# EAGLE design 1.0 (EAGLE 9.2.2)
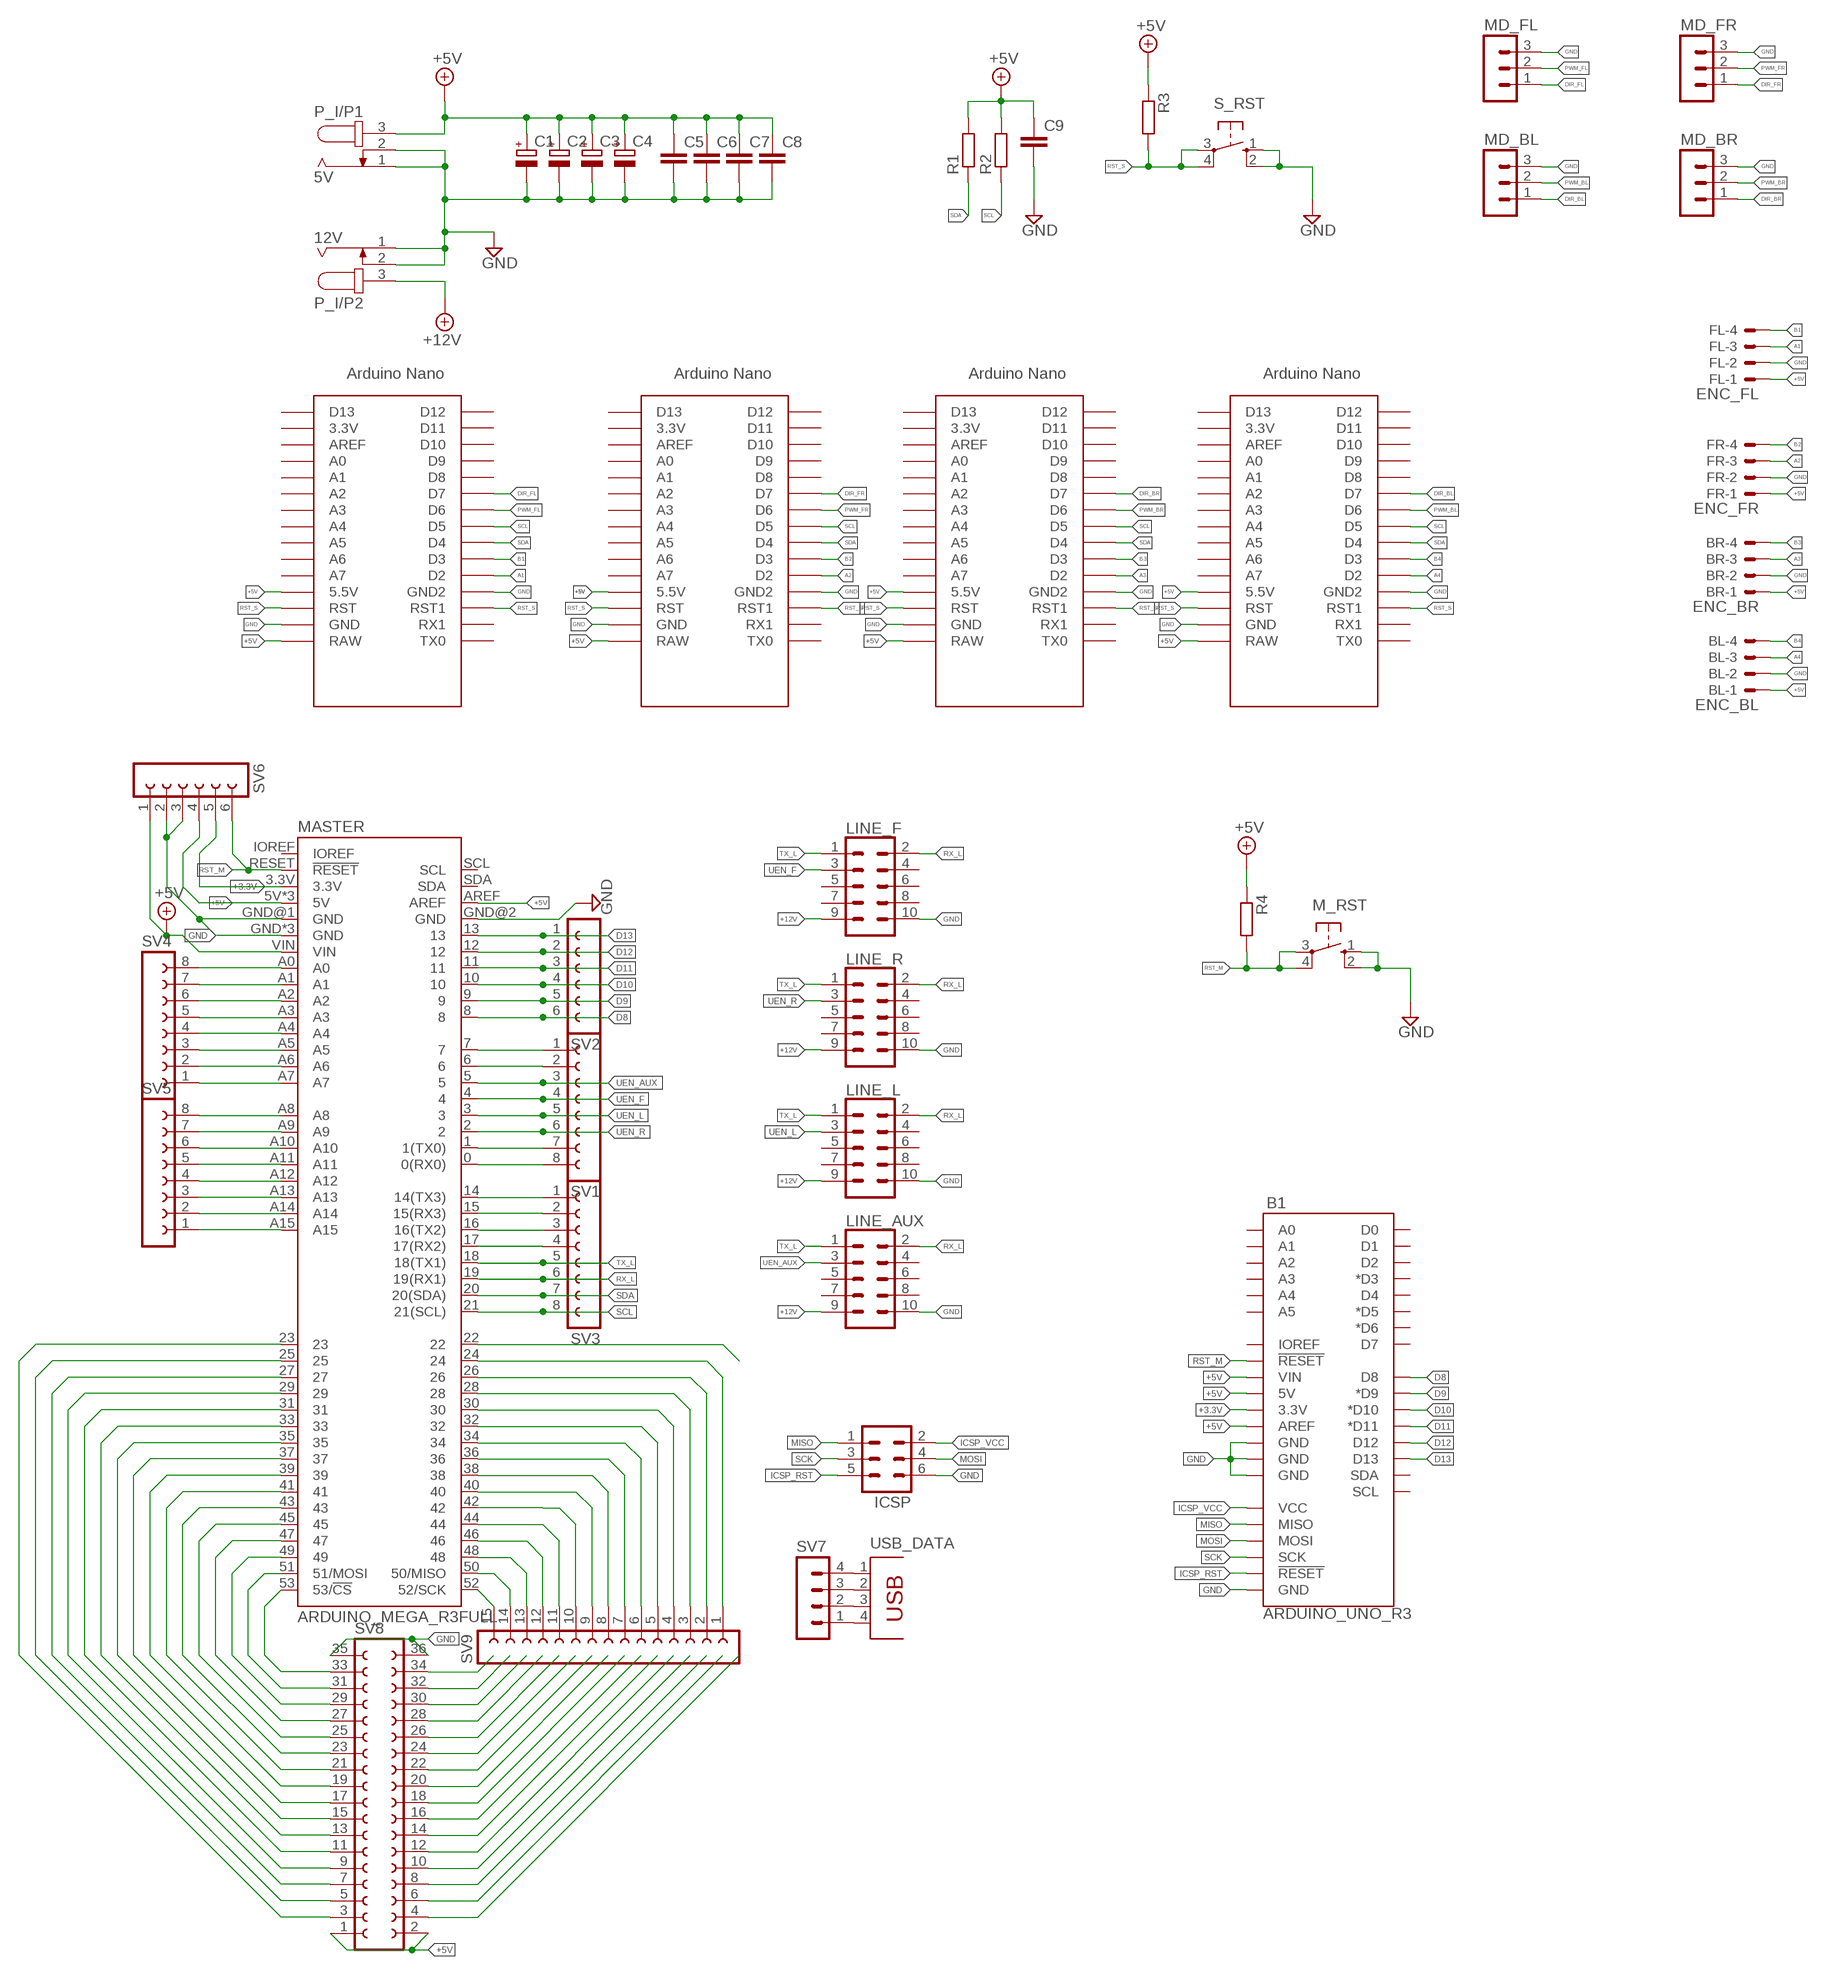
[diagram p0: schematic, sheet 1]

## Parts
B1  ARDUINO_UNO_R3  [ARDUINO_R3]
BL  ENC_BL  22-23-2041  [22-23-2041]
BR  ENC_BR  22-23-2041  [22-23-2041]
C1  CPOL-EUE5-10.5  [E5-10,5]
C2  CPOL-EUE5-10.5  [E5-10,5]
C3  CPOL-EUE5-10.5  [E5-10,5]
C4  CPOL-EUE5-10.5  [E5-10,5]
C5  C-EU050-035X075  [C050-035X075]
C6  C-EU050-035X075  [C050-035X075]
C7  C-EU050-035X075  [C050-035X075]
C8  C-EU050-035X075  [C050-035X075]
C9  C-EU050-035X075  [C050-035X075]
FL  ENC_FL  22-23-2041  [22-23-2041]
FR  ENC_FR  22-23-2041  [22-23-2041]
ICSP  MA03-2  [MA03-2]
LINE_AUX  CONN_05X2SHD_LOCK  [2X5-SHROUDED_LOCK]
LINE_F  CONN_05X2SHD_LOCK  [2X5-SHROUDED_LOCK]
LINE_L  CONN_05X2SHD_LOCK  [2X5-SHROUDED_LOCK]
LINE_R  CONN_05X2SHD_LOCK  [2X5-SHROUDED_LOCK]
M_RST  10-XX  [B3F-10XX]
MASTER  ARDUINO_MEGA_R3FULL  [ARDUINO_MEGA_NO_SILK]
MD_BL  MA03-1  [MA03-1]
MD_BR  MA03-1  [MA03-1]
MD_FL  MA03-1  [MA03-1]
MD_FR  MA03-1  [MA03-1]
P_I/P1  5V  JACK-PLUG1  [SPC4078]
P_I/P2  12V  JACK-PLUG1  [SPC4078]
R1  R-EU_0207/10  [0207/10]
R2  R-EU_0207/10  [0207/10]
R3  R-EU_0207/10  [0207/10]
R4  R-EU_0207/10  [0207/10]
S_RST  10-XX  [B3F-10XX]
SLAVE_0  NANO_08  NANO  [NANO]
SLAVE_1  NANO_09  NANO  [NANO]
SLAVE_2  NANO_11  NANO  [NANO]
SLAVE_3  NANO_10  NANO  [NANO]
SV1  FE08-1  [FE08]
SV2  FE06-1  [FE06]
SV3  FE08-1  [FE08]
SV4  FE08-1  [FE08]
SV5  FE08-1  [FE08]
SV6  FE06-1  [FE06]
SV7  MA04-1  [MA04-1]
SV8  FE18-2  [FE18-2]
SV9  FE15-1  [FE15]
USB_DATA  PN61729  [PN61729]

## Nets
+3.3V [power]: B1.3.3V MASTER.3.3V SV6.5
+5V: B1.5V B1.AREF B1.VIN BL.1 BR.1 C1.+ C2.+ C3.+ C4.+ C5.1 C6.1 C7.1 C8.1 C9.1 FL.1 FR.1 MASTER.5V MASTER.5V@1(5V) MASTER.5V@2(5V) MASTER.AREF MASTER.VIN P_I/P1.3 R1.2 R2.2 R3.1 R4.1 SLAVE_0.5V(5.5V) SLAVE_0.RAW SLAVE_1.5V(5.5V) SLAVE_1.RAW SLAVE_2.5V(5.5V) SLAVE_2.RAW SLAVE_3.5V(5.5V) SLAVE_3.RAW SV6.1 SV6.4 SV8.1 SV8.2
+12V: LINE_AUX.9 LINE_F.9 LINE_L.9 LINE_R.9 P_I/P2.3
A1: FL.3 SLAVE_0.D2
A2: FR.3 SLAVE_1.D2
A3: BR.3 SLAVE_2.D2
A4: BL.3 SLAVE_3.D2
B1: FL.4 SLAVE_0.D3
B2: FR.4 SLAVE_1.D3
B3: BR.4 SLAVE_2.D3
B4: BL.4 SLAVE_3.D3
D8: B1.D8 MASTER.8 SV2.6
D9: B1.D9(*D9) MASTER.9 SV2.5
D10: B1.D10(*D10) MASTER.10 SV2.4
D11: B1.D11(*D11) MASTER.11 SV2.3
D12: B1.D12 MASTER.12 SV2.2
D13: B1.D13 MASTER.13 SV2.1
DIR_BL: MD_BL.1 SLAVE_3.D7
DIR_BR: MD_BR.1 SLAVE_2.D7
DIR_FL: MD_FL.1 SLAVE_0.D7
DIR_FR: MD_FR.1 SLAVE_1.D7
GND: B1.GND@1(GND) B1.GND@2(GND) B1.GND@4(GND) BL.2 BR.2 C1.- C2.- C3.- C4.- C5.2 C6.2 C7.2 C8.2 C9.2 FL.2 FR.2 ICSP.6 LINE_AUX.10 LINE_F.10 LINE_L.10 LINE_R.10 M_RST.1(S) M_RST.2(S1) MASTER.GND MASTER.GND@1(GND) MASTER.GND@2(GND) MASTER.GND@3(GND) MASTER.GND@4(GND) MD_BL.3 MD_BR.3 MD_FL.3 MD_FR.3 P_I/P1.1 P_I/P1.2 P_I/P2.1 P_I/P2.2 S_RST.1(S) S_RST.2(S1) SLAVE_0.GND SLAVE_0.GND1(GND2) SLAVE_1.GND SLAVE_1.GND1(GND2) SLAVE_2.GND SLAVE_2.GND1(GND2) SLAVE_3.GND SLAVE_3.GND1(GND2) SV6.2 SV6.3 SV8.35 SV8.36
ICSP_RST: B1.RESET@2(!RESET!) ICSP.5
ICSP_VCC: B1.VCC ICSP.2
MISO: B1.MISO ICSP.1
MOSI: B1.MOSI ICSP.4
N$1: MASTER.14(14(TX3)) SV3.1
N$2: SV7.1 USB_DATA.4
N$3: SV7.2 USB_DATA.3
N$4: SV7.3 USB_DATA.2
N$5: SV7.4 USB_DATA.1
N$6: MASTER.22
N$7: MASTER.24 SV9.1
N$8: MASTER.0(0(RX0)) SV1.8
N$9: MASTER.1(1(TX0)) SV1.7
N$10: MASTER.15(15(RX3)) SV3.2
N$11: MASTER.16(16(TX2)) SV3.3
N$12: MASTER.17(17(RX2)) SV3.4
N$13: MASTER.53(53/!CS) SV8.33
N$14: MASTER.6 SV1.2
N$15: MASTER.7 SV1.1
N$16: MASTER.51(51/MOSI) SV8.31
N$17: MASTER.26 SV9.2
N$18: MASTER.47 SV8.27
N$19: MASTER.49 SV8.29
N$20: MASTER.45 SV8.25
N$21: MASTER.43 SV8.23
N$22: MASTER.41 SV8.21
N$23: MASTER.39 SV8.19
N$24: MASTER.A0 SV4.8
N$25: MASTER.A1 SV4.7
N$26: MASTER.A2 SV4.6
N$27: MASTER.A3 SV4.5
N$28: MASTER.A4 SV4.4
N$29: MASTER.A5 SV4.3
N$30: MASTER.A6 SV4.2
N$31: MASTER.A7 SV4.1
N$32: MASTER.A8 SV5.8
N$33: MASTER.A9 SV5.7
N$34: MASTER.A10 SV5.6
N$35: MASTER.A11 SV5.5
N$36: MASTER.A12 SV5.4
N$37: MASTER.A13 SV5.3
N$38: MASTER.A14 SV5.2
N$39: MASTER.A15 SV5.1
N$40: MASTER.37 SV8.17
N$41: MASTER.35 SV8.15
N$42: MASTER.33 SV8.13
N$43: MASTER.31 SV8.11
N$44: MASTER.29 SV8.9
N$45: MASTER.27 SV8.7
N$46: MASTER.25 SV8.5
N$47: MASTER.23 SV8.3
N$48: SV8.4
N$49: SV8.6
N$50: SV8.8
N$51: SV8.10
N$52: SV8.12
N$53: SV8.14
N$54: SV8.16
N$55: SV8.18
N$56: SV8.20
N$57: SV8.22
N$58: MASTER.28 SV9.3
N$59: SV8.26
N$60: SV8.28
N$61: SV8.30
N$62: SV8.32
N$63: SV8.34
N$64: B1.GND@3(GND)
N$65: MASTER.30 SV9.4
N$66: MASTER.32 SV9.5
N$67: MASTER.34 SV9.6
N$68: MASTER.36 SV9.7
N$69: SV8.24
N$70: MASTER.38 SV9.8
N$71: MASTER.40 SV9.9
N$72: MASTER.42 SV9.10
N$73: MASTER.52(52/SCK) SV9.15
N$74: MASTER.50(50/MISO) SV9.14
N$75: MASTER.48 SV9.13
N$76: MASTER.46 SV9.12
N$77: MASTER.44 SV9.11
PWM_BL: MD_BL.2 SLAVE_3.D6
PWM_BR: MD_BR.2 SLAVE_2.D6
PWM_FL: MD_FL.2 SLAVE_0.D6
PWM_FR: MD_FR.2 SLAVE_1.D6
RST_M: B1.RESET@1(!RESET!) M_RST.3(P) M_RST.4(P1) MASTER.RESET(!RESET) R4.2 SV6.6
RST_S: R3.2 S_RST.3(P) S_RST.4(P1) SLAVE_0.RST SLAVE_0.RST1 SLAVE_1.RST SLAVE_1.RST1 SLAVE_2.RST SLAVE_2.RST1 SLAVE_3.RST SLAVE_3.RST1
RX_L: LINE_AUX.2 LINE_F.2 LINE_L.2 LINE_R.2 MASTER.19(19(RX1)) SV3.6
SCK: B1.SCK ICSP.3
SCL: MASTER.21(21(SCL)) R2.1 SLAVE_0.D5 SLAVE_1.D5 SLAVE_2.D5 SLAVE_3.D5 SV3.8
SDA: MASTER.20(20(SDA)) R1.1 SLAVE_0.D4 SLAVE_1.D4 SLAVE_2.D4 SLAVE_3.D4 SV3.7
TX_L: LINE_AUX.1 LINE_F.1 LINE_L.1 LINE_R.1 MASTER.18(18(TX1)) SV3.5
UEN_AUX: LINE_AUX.3 MASTER.5 SV1.3
UEN_F: LINE_F.3 MASTER.4 SV1.4
UEN_L: LINE_L.3 MASTER.3 SV1.5
UEN_R: LINE_R.3 MASTER.2 SV1.6
Unconnected: B1.A0 B1.A1 B1.A2 B1.A3 B1.A4 B1.A5 B1.D0 B1.D1 B1.D2 B1.D3(*D3) B1.D4 B1.D5(*D5) B1.D6(*D6) B1.D7 B1.IOREF B1.SCL B1.SDA LINE_AUX.4 LINE_AUX.5 LINE_AUX.6 LINE_AUX.7 LINE_AUX.8 LINE_F.4 LINE_F.5 LINE_F.6 LINE_F.7 LINE_F.8 LINE_L.4 LINE_L.5 LINE_L.6 LINE_L.7 LINE_L.8 LINE_R.4 LINE_R.5 LINE_R.6 LINE_R.7 LINE_R.8 MASTER.IOREF MASTER.SCL MASTER.SDA SLAVE_0.3.3V SLAVE_0.A0 SLAVE_0.A1 SLAVE_0.A2 SLAVE_0.A3 SLAVE_0.A4 SLAVE_0.A5 SLAVE_0.A6 SLAVE_0.A7 SLAVE_0.AREF SLAVE_0.D8 SLAVE_0.D9 SLAVE_0.D10 SLAVE_0.D11 SLAVE_0.D12 SLAVE_0.D13 SLAVE_0.ICSP1 SLAVE_0.ICSP2 SLAVE_0.ICSP3 SLAVE_0.ICSP4 SLAVE_0.ICSP5 SLAVE_0.ICSP6 SLAVE_0.RX1 SLAVE_0.TX0 SLAVE_1.3.3V SLAVE_1.A0 SLAVE_1.A1 SLAVE_1.A2 SLAVE_1.A3 SLAVE_1.A4 SLAVE_1.A5 SLAVE_1.A6 SLAVE_1.A7 SLAVE_1.AREF SLAVE_1.D8 SLAVE_1.D9 SLAVE_1.D10 SLAVE_1.D11 SLAVE_1.D12 SLAVE_1.D13 SLAVE_1.ICSP1 SLAVE_1.ICSP2 SLAVE_1.ICSP3 SLAVE_1.ICSP4 SLAVE_1.ICSP5 SLAVE_1.ICSP6 SLAVE_1.RX1 SLAVE_1.TX0 SLAVE_2.3.3V SLAVE_2.A0 SLAVE_2.A1 SLAVE_2.A2 SLAVE_2.A3 SLAVE_2.A4 SLAVE_2.A5 SLAVE_2.A6 SLAVE_2.A7 SLAVE_2.AREF SLAVE_2.D8 SLAVE_2.D9 SLAVE_2.D10 SLAVE_2.D11 SLAVE_2.D12 SLAVE_2.D13 SLAVE_2.ICSP1 SLAVE_2.ICSP2 SLAVE_2.ICSP3 SLAVE_2.ICSP4 SLAVE_2.ICSP5 SLAVE_2.ICSP6 SLAVE_2.RX1 SLAVE_2.TX0 SLAVE_3.3.3V SLAVE_3.A0 SLAVE_3.A1 SLAVE_3.A2 SLAVE_3.A3 SLAVE_3.A4 SLAVE_3.A5 SLAVE_3.A6 SLAVE_3.A7 SLAVE_3.AREF SLAVE_3.D8 SLAVE_3.D9 SLAVE_3.D10 SLAVE_3.D11 SLAVE_3.D12 SLAVE_3.D13 SLAVE_3.ICSP1 SLAVE_3.ICSP2 SLAVE_3.ICSP3 SLAVE_3.ICSP4 SLAVE_3.ICSP5 SLAVE_3.ICSP6 SLAVE_3.RX1 SLAVE_3.TX0

## Library data of the parts
B1 = SparkFun-Boards:ARDUINO_UNO_R3: Arduino R3 Footprint with SPI header Arduino Uno R3 Compatible Footprint. Matches PCB size of the original board. SparkFun Products: SAMD21 Dev Breakout <https://www.sparkfun.com/products/13672> RedBoard <https://www.sparkfun.com/products/12757> R3 Stackable Headers <https://www.sparkfun.com/products/11417>
BL BR FL FR = con-molex:22-23-2041: .100" (2.54mm) Center Header - 4 Pin; MF: MOLEX; MPN: 22-23-2041; OC_FARNELL: 1462920; OC_NEWARK: 38C0355
C1-C4 = rcl:CPOL-EU: POLARIZED CAPACITOR, European symbol; SPICEPREFIX: C
C5-C9 = rcl:C-EU: CAPACITOR, European symbol; SPICEPREFIX: C
ICSP = con-lstb:MA03-2: PIN HEADER; OC_FARNELL: unknown; OC_NEWARK: unknown
LINE_AUX LINE_F LINE_L LINE_R = SparkFun-Connectors:CONN_05X2: Multi connection point. Often used as Generic Header-pin footprint for 0.1 inch spaced/style header connections For AVR SPI programming port, see special device with nice symbol: "AVR_SPI_PROG_5x2.dev" You can populate with any combo of single row headers, but if you'd like an exact match, check these: 2x5 AVR ICSP Male Header <https://www.sparkfun.com/products/778> (PRT-00778) 2x5 Pin Shrouded Header <https://www.sparkfun.com/products/8506> (PRT-08506) On any of the 0.1 inch spaced packages, you can populate with these: Break Away Headers - Straight <https://www.sparkfun.com/products/116> (PRT-00116) Break Away Male Headers - Right Angle <https://www.sparkfun.com/products/553> (PRT-00553) Female Headers <https://www.sparkfun.com/products/115> (PRT-00115) Break Away Headers - Machine Pin <https://www.sparkfun.com/products/117> (PRT-00117) Break Away Female Headers - Swiss Machine Pin <https://www.sparkfun.com/products/743> (PRT-00743) Special note: the shrouded connector mates well with our 5x2 ribbon cables: 2x5 Pin IDC Ribbon Cable <https://www.sparkfun.com/products/8535> (PRT-08535); PROD_ID: CONN-08671; SF_ID: PRT-08506
M_RST S_RST = switch-omron:10-XX: OMRON SWITCH; MPN: B3F-1000; OC_FARNELL: 176432; OC_NEWARK: 36M3542
MASTER = SparkFun-Boards:ARDUINO_MEGA_R3: Arduino Mega R3 ATmega2560 R3 compatible footprint. SparkFun Products: Arduino Mega 2560 R3 <https://www.sparkfun.com/products/11061>
MD_BL MD_BR MD_FL MD_FR = con-lstb:MA03-1: PIN HEADER; OC_FARNELL: unknown; OC_NEWARK: unknown
P_I/P1 P_I/P2 = con-jack:JACK-PLUG: DC POWER JACK Power Jack, DC, Right Angle, Through Hole, Rated 5A at 16VDC, PC Terminals Distributor: Farnell (www.Farnell.de) Drawing: 84N1161.pdf / 84N1162.pdf Manufacturer: SPC Technology (www.spctechnology.com) Type: SPC4077 / SPC 4078; OC_FARNELL: unknown; OC_NEWARK: unknown
R1-R4 = rcl:R-EU_: RESISTOR, European symbol; SPICEPREFIX: R
SLAVE_0 SLAVE_1-SLAVE_3 = Arduino-clone:NANO: Arduino Nano
SV1 SV3-SV5 = con-lsta:FE08-1: FEMALE HEADER; OC_FARNELL: unknown; OC_NEWARK: unknown
SV2 SV6 = con-lsta:FE06-1: FEMALE HEADER; OC_FARNELL: unknown; OC_NEWARK: unknown
SV7 = con-lstb:MA04-1: PIN HEADER; OC_FARNELL: unknown; OC_NEWARK: unknown
SV8 = con-lsta:FE18-2: FEMALE HEADER; OC_FARNELL: unknown; OC_NEWARK: unknown
SV9 = con-lsta:FE15-1: FEMALE HEADER; OC_FARNELL: unknown; OC_NEWARK: unknown
USB_DATA = con-berg:PN61729: BERG USB connector; OC_FARNELL: unknown; OC_NEWARK: unknown

## Net classes
1 power: width 0.254 mm, drill 0.584 mm, clearance 0.203 mm
2 gnd: width 0.254 mm, drill 0.584 mm, clearance 0.203 mm

## Board
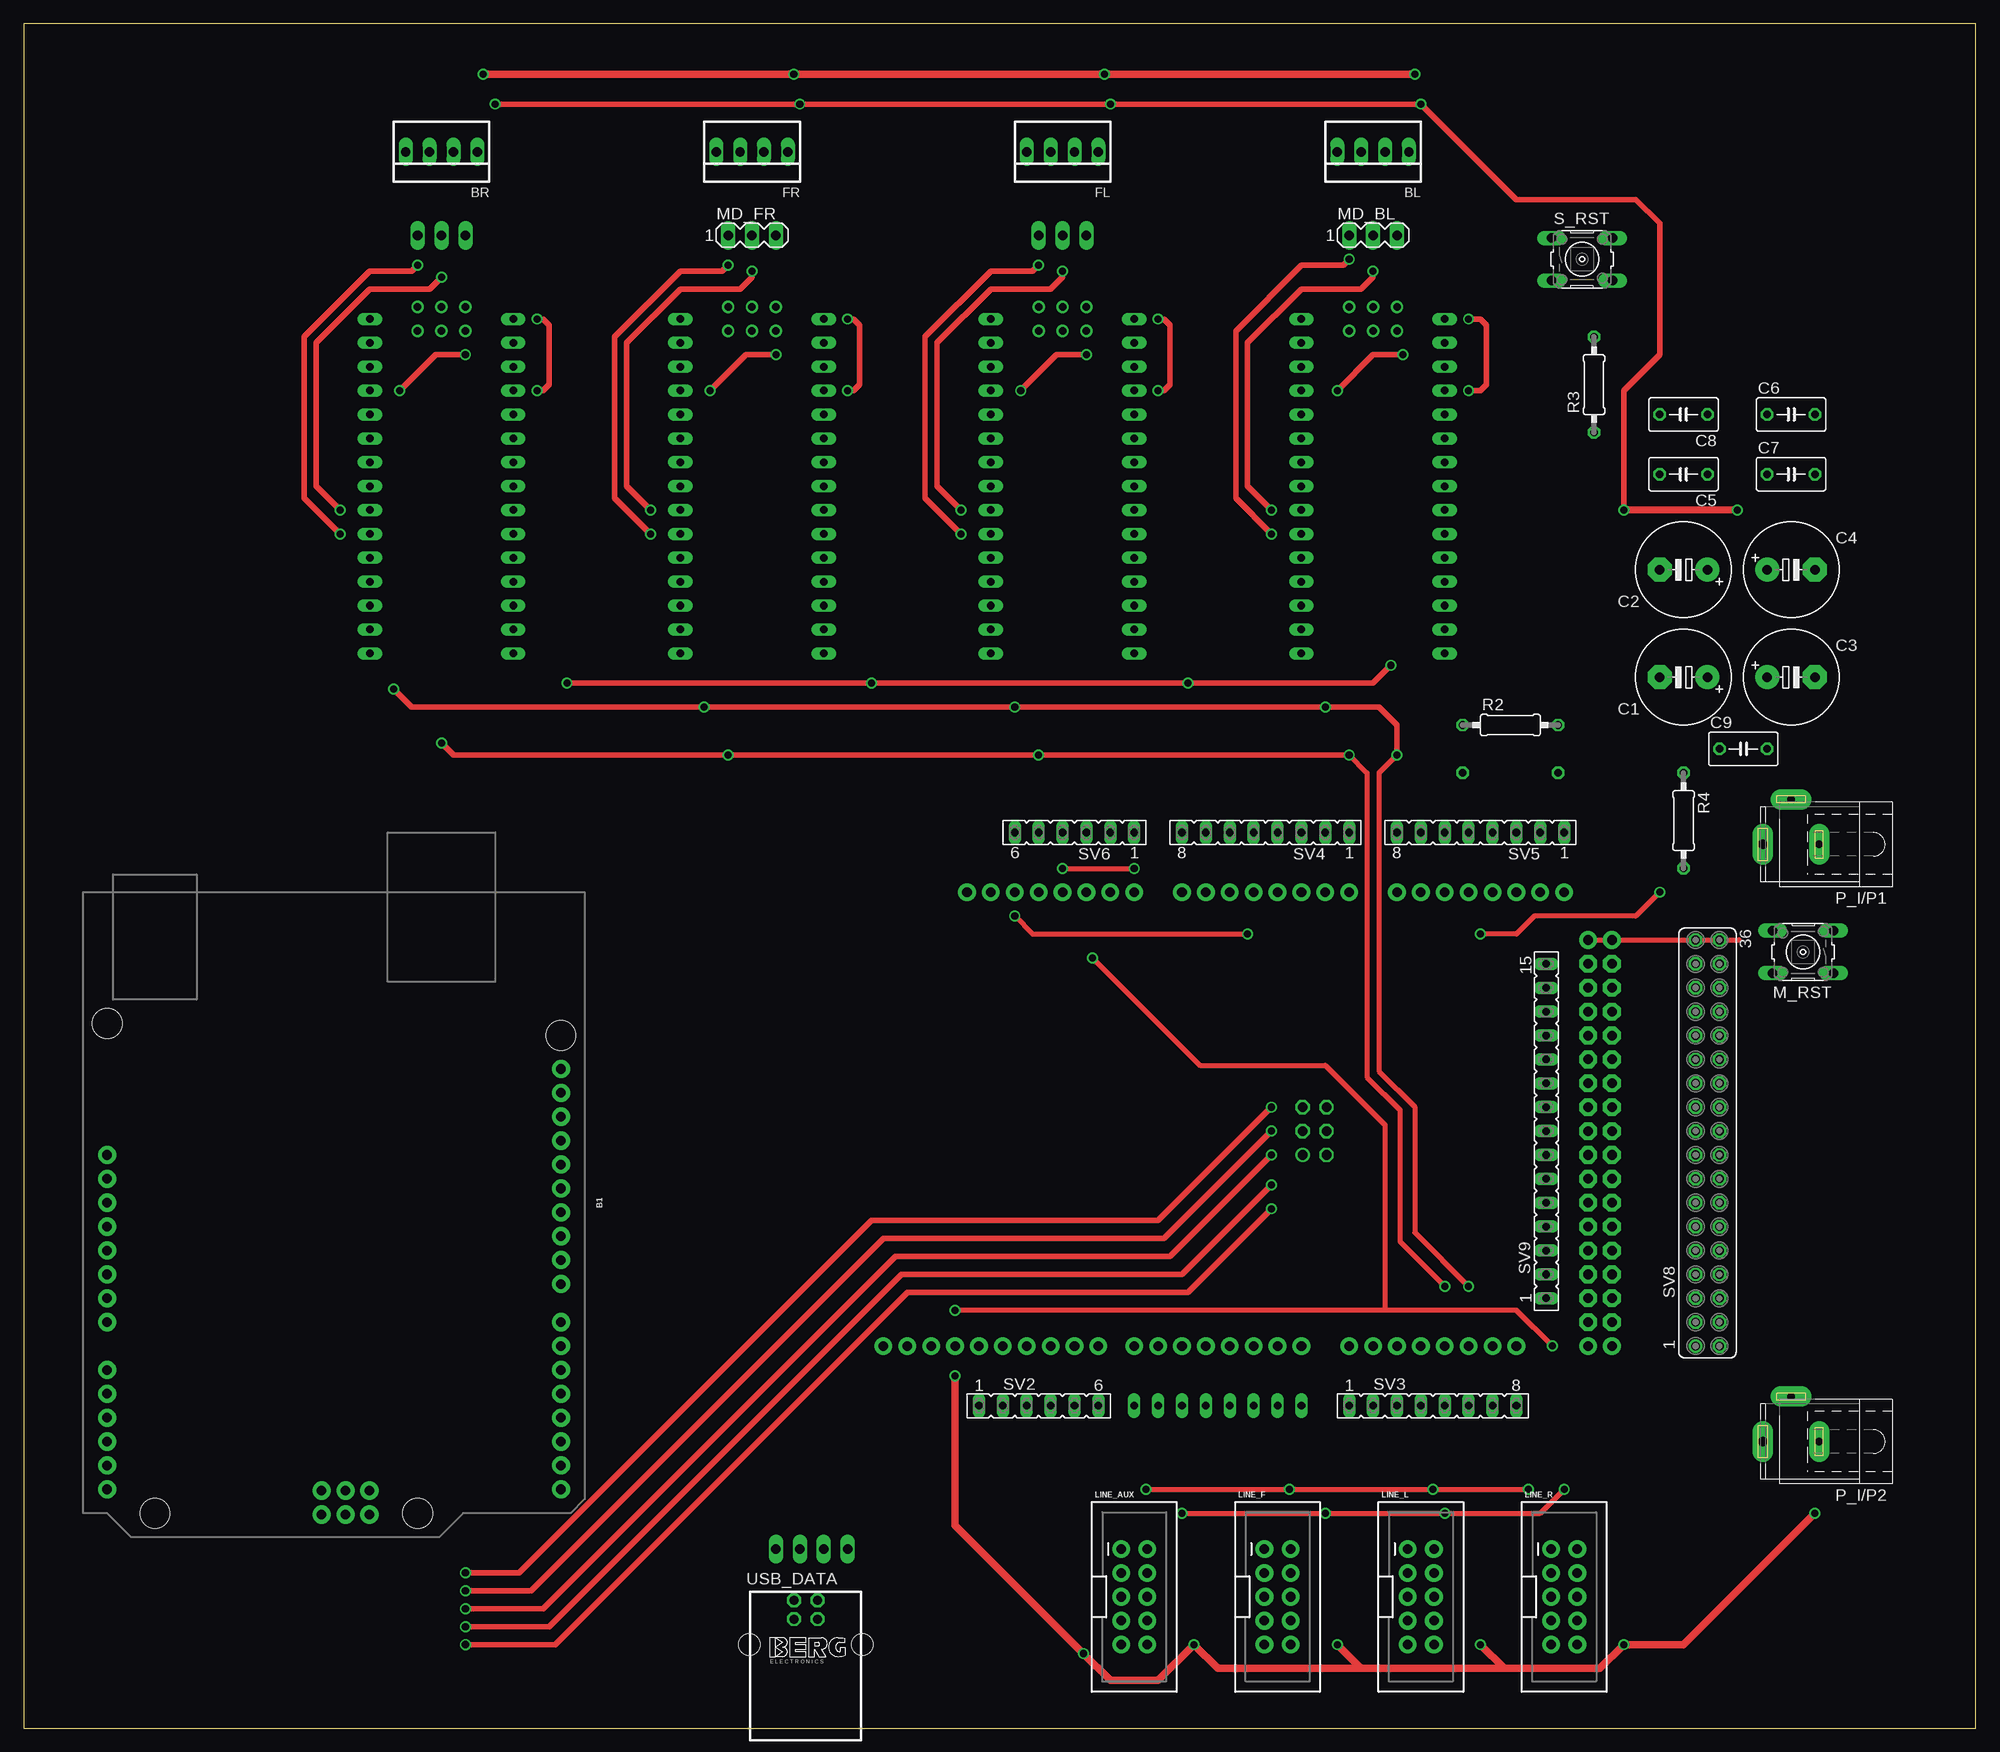
[diagram p1: board, top side]
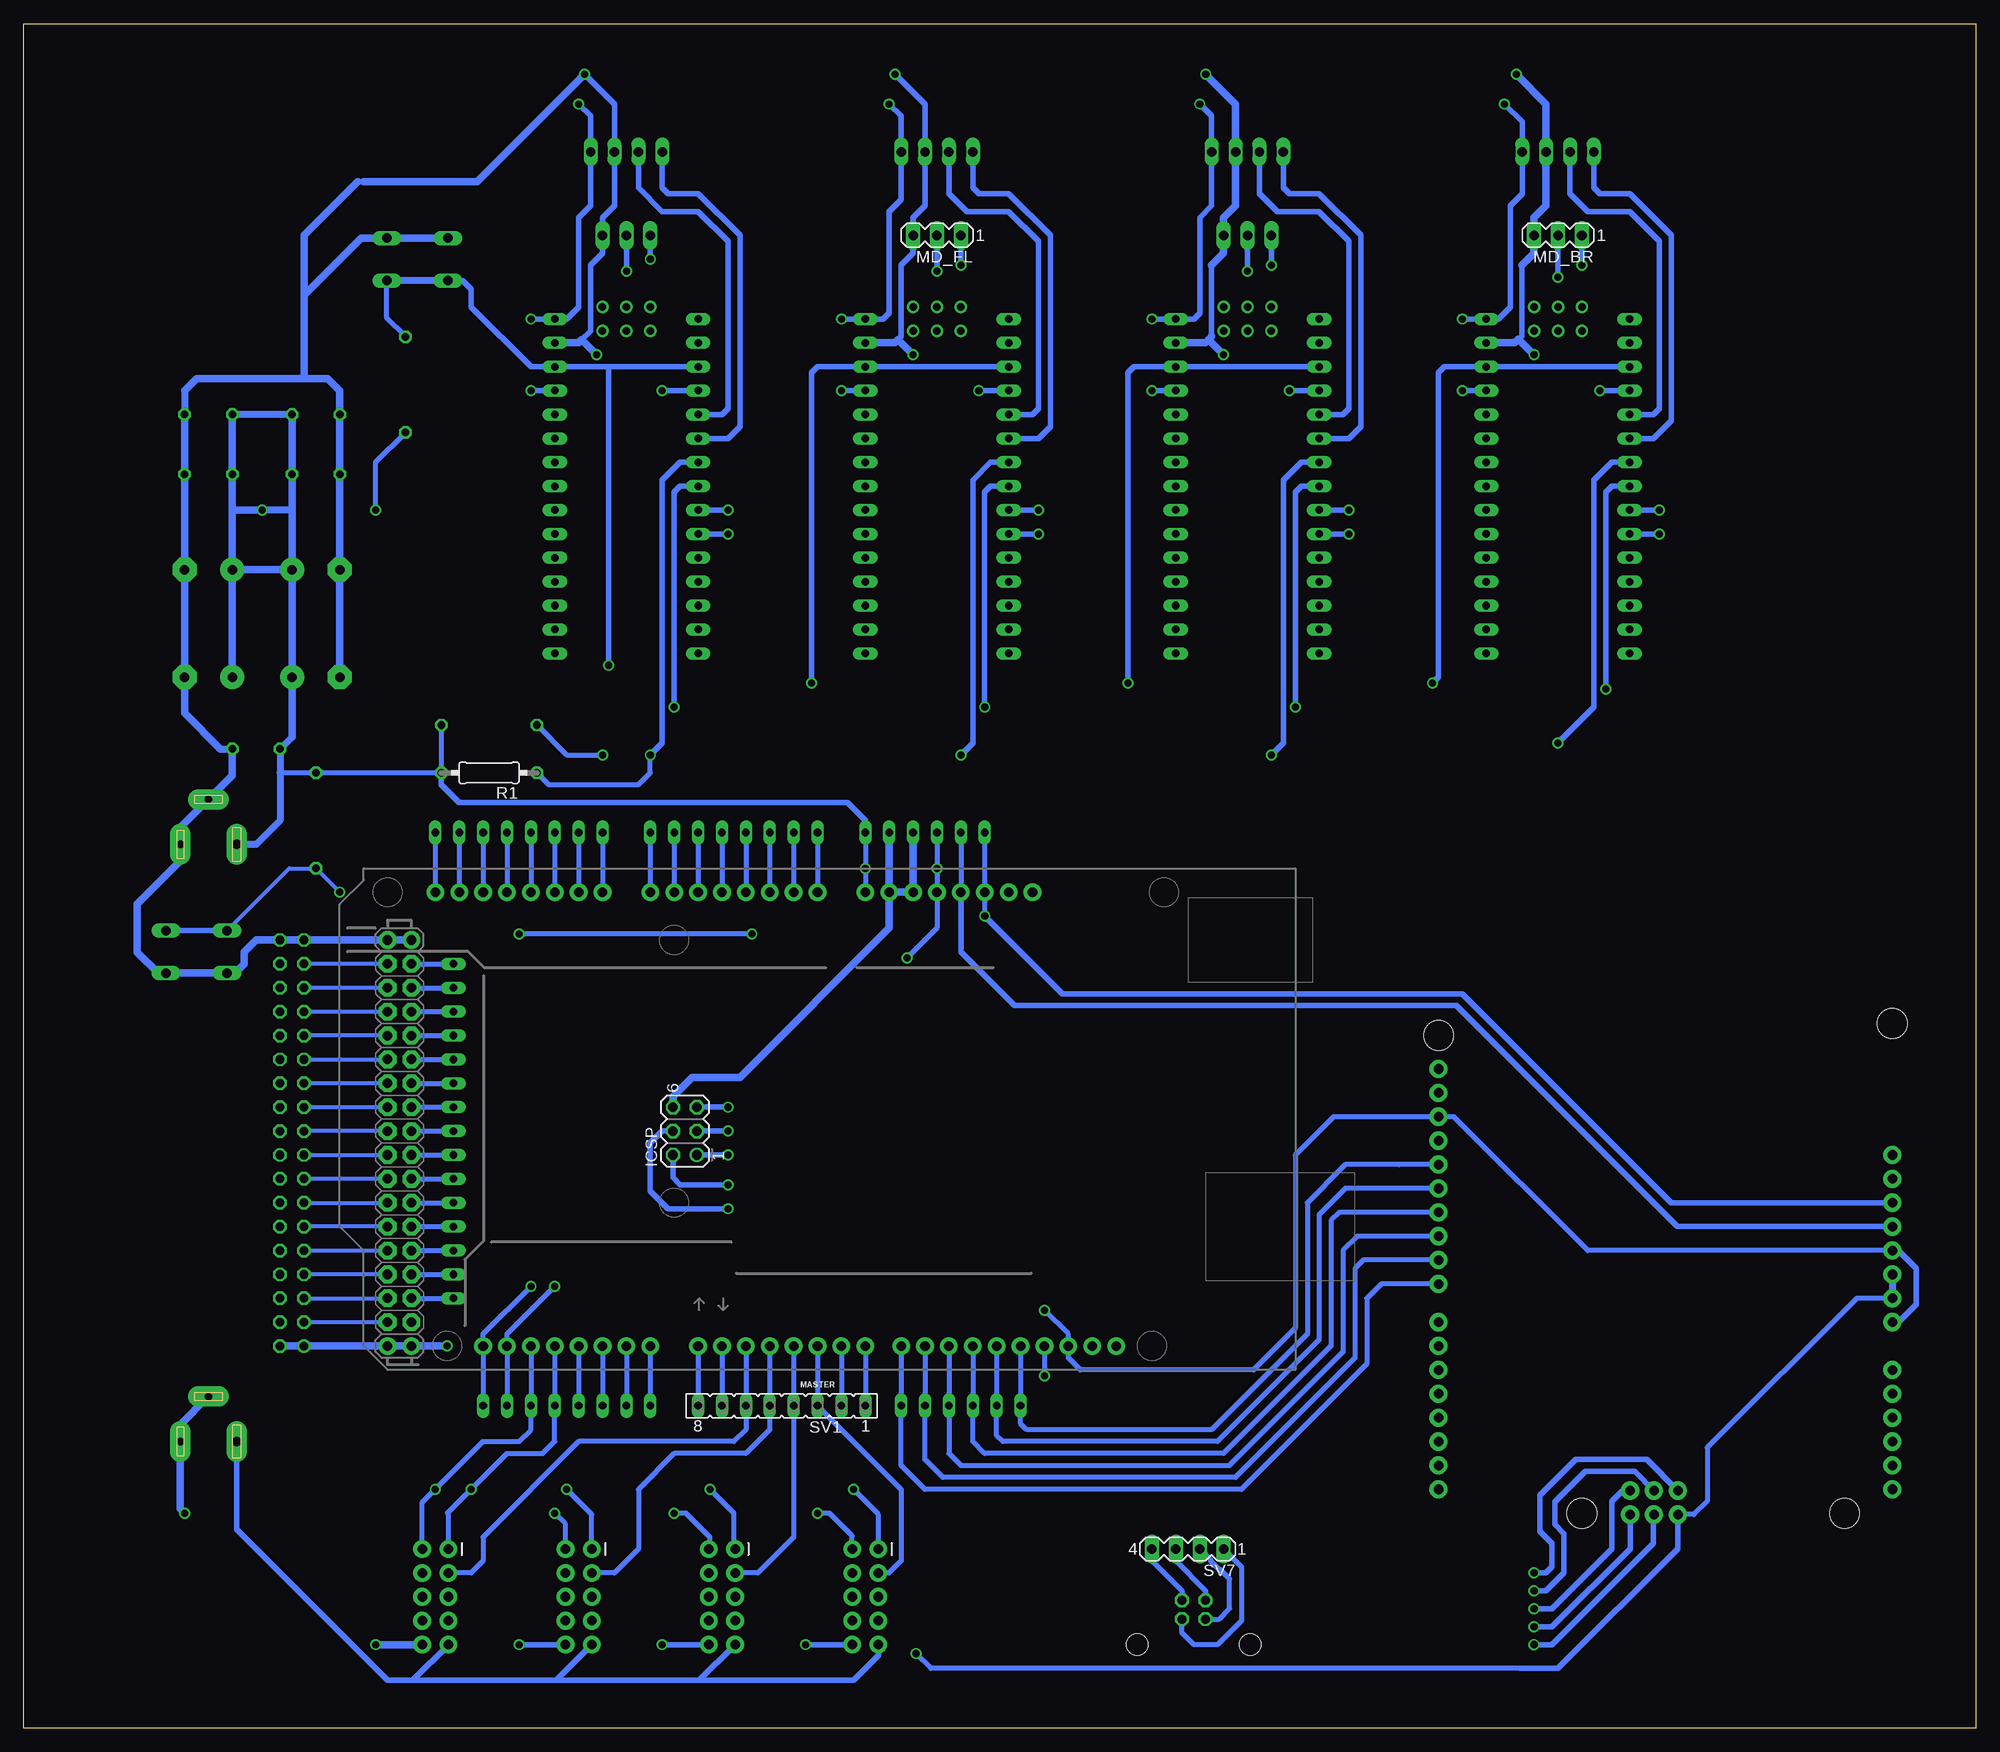
[diagram p2: board, bottom side, seen from below]

Size 207.62 x 181.28 mm. Coordinates in mm from the lower left corner, seen from the top.
Outline: 0,0 207.62,0 207.62,181.28 0,181.28 0,0
Copper layers (1*16): Top 0.035mm / dielectric 1.5mm / Bottom 0.035mm
Design rules "default *": minimum track width 17mil, minimum drill 0.35mm, track to track 13mil, track to pad 13mil, pad to pad 13mil, via to via 13mil, smd to smd 6mil, copper to edge 40mil, drill to drill 13mil, minimum pad ring 10mil, minimum via ring 8mil, stop-mask expansion 4mil, vias tented up to drill 0mil, thermal gap 15mil

### Footprints (pad centres in the part's own frame; a part is rotated, then mirrored left to right if it is on the bottom)
ARDUINO_R3 = drill 1.016 pad 1.93: 3.3V 2.54,-24.13; 5V 5.08,-24.13; A0 17.78,-24.13; A1 20.32,-24.13; A2 22.86,-24.13; A3 25.4,-24.13; A4 27.94,-24.13; A5 30.48,-24.13; AREF -9.144,24.13; D0 30.48,24.13; D1 27.94,24.13; D2 25.4,24.13; D3 22.86,24.13; D4 20.32,24.13; D5 17.78,24.13; D6 15.24,24.13; D7 12.7,24.13; D8 8.636,24.13; D9 6.096,24.13; D10 3.556,24.13; D11 1.016,24.13; D12 -1.524,24.13; D13 -4.064,24.13; GND@1 7.62,-24.13; GND@2 10.16,-24.13; GND@3 -6.604,24.13; GND@4 33.16,-1.32; IOREF -2.54,-24.13; MISO 30.62,3.76; MOSI 33.16,1.22; NC -5.08,-24.13; RESET@1 0,-24.13; RESET@2 30.62,-1.32; SCK 30.62,1.22; SCL -14.224,24.13; SDA -11.684,24.13; VCC 33.16,3.76; VIN 12.7,-24.13 | hole 3.175: -17.78,24.13; 33.02,8.89; 33.02,-19.05; -19.05,-24.13
22-23-2041 = drill 1 long: 1 -3.81,0; 2 -1.27,0; 3 1.27,0; 4 3.81,0
E5-10,5 = drill 1.016 pad 2.54: + -2.54,0 | drill 1.016 pad 2.54 octagon: - 2.54,0
C050-035X075 = drill 0.813 octagon: 1 -2.54,0; 2 2.54,0
MA03-2 = drill 1.016: 1 -2.54,-1.27 | drill 1.016 octagon: 2 -2.54,1.27; 3 0,-1.27; 4 0,1.27; 5 2.54,-1.27; 6 2.54,1.27
2X5-SHROUDED_LOCK = drill 1.016 pad 1.88: 1 -1.397,5.08; 2 1.397,5.08; 3 -1.397,2.54; 4 1.397,2.54; 5 -1.397,0; 6 1.397,0; 7 -1.397,-2.54; 8 1.397,-2.54; 9 -1.397,-5.08; 10 1.397,-5.08
B3F-10XX = drill 1.016 long: 1 -3.251,2.261; 2 3.251,2.261; 3 -3.251,-2.261; 4 3.251,-2.261
ARDUINO_MEGA_NO_SILK = drill 1.016 pad 1.88: 0 13.97,24.13; 1 11.43,24.13; 2 8.89,24.13; 3 6.35,24.13; 3.3V -13.97,-24.13; 4 3.81,24.13; 5 1.27,24.13; 5V -11.43,-24.13; 5V@1 44.45,24.13; 5V@2 46.99,24.13; 6 -1.27,24.13; 7 -3.81,24.13; 8 -7.62,24.13; 9 -10.16,24.13; 10 -12.7,24.13; 11 -15.24,24.13; 12 -17.78,24.13; 13 -20.32,24.13; 14 19.05,24.13; 15 21.59,24.13; 16 24.13,24.13; 17 26.67,24.13; 18 29.21,24.13; 19 31.75,24.13; 20 34.29,24.13; 21 36.83,24.13; A0 1.27,-24.13; A1 3.81,-24.13; A2 6.35,-24.13; A3 8.89,-24.13; A4 11.43,-24.13; A5 13.97,-24.13; A6 16.51,-24.13; A7 19.05,-24.13; A8 24.13,-24.13; A9 26.67,-24.13; A10 29.21,-24.13; A11 31.75,-24.13; A12 34.29,-24.13; A13 36.83,-24.13; A14 39.37,-24.13; A15 41.91,-24.13; AREF -25.4,24.13; GND -8.89,-24.13; GND@1 -6.35,-24.13; GND@2 44.45,-19.05; GND@3 46.99,-19.05; GND@4 -22.86,24.13; IOREF -19.05,-24.13; NC -21.59,-24.13; RESET -16.51,-24.13; SCL -30.48,24.13; SDA -27.94,24.13; VIN -3.81,-24.13 | drill 1.016 pad 1.88 octagon: 22 44.45,21.59; 23 46.99,21.59; 24 44.45,19.05; 25 46.99,19.05; 26 44.45,16.51; 27 46.99,16.51; 28 44.45,13.97; 29 46.99,13.97; 30 44.45,11.43; 31 46.99,11.43; 32 44.45,8.89; 33 46.99,8.89; 34 44.45,6.35; 35 46.99,6.35; 36 44.45,3.81; 37 46.99,3.81; 38 44.45,1.27; 39 46.99,1.27; 40 44.45,-1.27; 41 46.99,-1.27; 42 44.45,-3.81; 43 46.99,-3.81; 44 44.45,-6.35; 45 46.99,-6.35; 46 44.45,-8.89; 47 46.99,-8.89; 48 44.45,-11.43; 49 46.99,-11.43; 50 44.45,-13.97; 51 46.99,-13.97; 52 44.45,-16.51; 53 46.99,-16.51
MA03-1 = drill 1.016 long: 1 -2.54,0; 2 0,0; 3 2.54,0
SPC4078 = drill 0.8 pad 2.184 long: 1 -3,0; 2 0,-4.8 | drill 1 pad 2.184 long: 3 3,0
0207/10 = drill 0.813 octagon: 1 -5.08,0; 2 5.08,0
NANO = drill 0.8 long: 3.3V -10.16,24.13; 5V -10.16,-1.27; A0 -10.16,19.05; A1 -10.16,16.51; A2 -10.16,13.97; A3 -10.16,11.43; A4 -10.16,8.89; A5 -10.16,6.35; A6 -10.16,3.81; A7 -10.16,1.27; AREF -10.16,21.59; D2 5.08,1.27; D3 5.08,3.81; D4 5.08,6.35; D5 5.08,8.89; D6 5.08,11.43; D7 5.08,13.97; D8 5.08,16.51; D9 5.08,19.05; D10 5.08,21.59; D11 5.08,24.13; D12 5.08,26.67; D13 -10.16,26.67; GND -10.16,-6.35; GND1 5.08,-1.27; RAW -10.16,-8.89; RST -10.16,-3.81; RST1 5.08,-3.81; RX1 5.08,-6.35; TX0 5.08,-8.89 | drill 0.8: ICSP1 -5.08,-10.16; ICSP2 -5.08,-7.62; ICSP3 -2.54,-10.16; ICSP4 -2.54,-7.62; ICSP5 0,-10.16; ICSP6 0,-7.62
FE08 = drill 0.813 long: 1 -8.89,0; 2 -6.35,0; 3 -3.81,0; 4 -1.27,0; 5 1.27,0; 6 3.81,0; 7 6.35,0; 8 8.89,0
FE06 = drill 0.813 long: 1 -6.35,0; 2 -3.81,0; 3 -1.27,0; 4 1.27,0; 5 3.81,0; 6 6.35,0
MA04-1 = drill 1.016 long: 1 -3.81,0; 2 -1.27,0; 3 1.27,0; 4 3.81,0
FE18-2 = drill 0.914: 1 -21.59,1.27 | drill 0.914 octagon: 2 -21.59,-1.27; 3 -19.05,1.27; 4 -19.05,-1.27; 5 -16.51,1.27; 6 -16.51,-1.27; 7 -13.97,1.27; 8 -13.97,-1.27; 9 -11.43,1.27; 10 -11.43,-1.27; 11 -8.89,1.27; 12 -8.89,-1.27; 13 -6.35,1.27; 14 -6.35,-1.27; 15 -3.81,1.27; 16 -3.81,-1.27; 17 -1.27,1.27; 18 -1.27,-1.27; 19 1.27,1.27; 20 1.27,-1.27; 21 3.81,1.27; 22 3.81,-1.27; 23 6.35,1.27; 24 6.35,-1.27; 25 8.89,1.27; 26 8.89,-1.27; 27 11.43,1.27; 28 11.43,-1.27; 29 13.97,1.27; 30 13.97,-1.27; 31 16.51,1.27; 32 16.51,-1.27; 33 19.05,1.27; 34 19.05,-1.27; 35 21.59,1.27; 36 21.59,-1.27
FE15 = drill 0.813 long: 1 -17.78,0; 2 -15.24,0; 3 -12.7,0; 4 -10.16,0; 5 -7.62,0; 6 -5.08,0; 7 -2.54,0; 8 0,0; 9 2.54,0; 10 5.08,0; 11 7.62,0; 12 10.16,0; 13 12.7,0; 14 15.24,0; 15 17.78,0
PN61729 = drill 0.95 octagon: 1 1.25,4.71; 2 -1.25,4.71; 3 -1.25,2.71; 4 1.25,2.71 | hole 2.3: -6.02,0; 6.02,0

### Placement (x,y rotation side)
B1  33.02,55.88 270 top
BL  143.51,167.64 180 top
BR  44.45,167.64 180 top
C1  176.53,111.76 180 top
C2  176.53,123.19 180 top
C3  187.96,111.76 0 top
C4  187.96,123.19 0 top
C5  176.53,133.35 180 top
C6  187.96,139.7 0 top
C7  187.96,133.35 0 top
C8  176.53,139.7 180 top
C9  182.88,104.14 0 top
FL  110.49,167.64 180 top
FR  77.47,167.64 180 top
ICSP  137.29,63.5 90 bottom
LINE_AUX  118.11,13.97 0 top
LINE_F  133.35,13.97 0 top
LINE_L  148.59,13.97 0 top
LINE_R  163.83,13.97 0 top
M_RST  189.23,82.55 180 top
MASTER  121.92,64.77 180 bottom
MD_BL  143.51,158.75 0 top
MD_BR  44.45,158.75 180 bottom
MD_FL  110.49,158.75 180 bottom
MD_FR  77.47,158.75 0 top
P_I/P1  187.96,93.98 180 top
P_I/P2  187.96,30.48 180 top
R1  158.12,101.6 180 bottom
R2  158.12,106.68 0 top
R3  167,142.88 90 top
R4  176.53,96.52 270 top
S_RST  165.74,156.21 0 top
SLAVE_0  107.95,140.97 180 top
SLAVE_1  74.93,140.97 180 top
SLAVE_2  41.91,140.97 180 top
SLAVE_3  140.97,140.97 180 top
SV1  127,34.29 180 bottom
SV2  107.95,34.29 0 top
SV3  149.86,34.29 0 top
SV4  132.08,95.25 180 top
SV5  154.94,95.25 180 top
SV6  111.76,95.25 180 top
SV7  83.82,19.05 180 bottom
SV8  179.07,62.23 90 top
SV9  161.93,63.5 90 top
USB_DATA  83.19,8.89 0 top

### Tracks (layer width: path | path; a pad name or v marks a point on that pad's centre or on a via)
+3.3V
  Bottom 0.508: SV6.5 MASTER.3.3V
  Bottom 0.559: MASTER.3.3V 107.95,82.55 102.24,76.84 55.25,76.84 31.75,53.34 B1.3.3V
+5V  (via drill 0.75)
  Top 0.508: v110.49,91.44 v118.11,91.44 | v162.56,40.64 158.75,44.45 144.78,44.45 | 144.78,44.45 128.27,44.45 v99.06,44.45 | v113.67,81.91 125.1,70.48 138.43,70.48 144.78,64.14 144.78,44.45
  Top 0.61: v50.17,172.72 v82.55,172.72 v115.57,172.72 v148.59,172.72 158.75,162.56 171.45,162.56 173.99,160.02 173.99,146.05 170.18,142.24 v170.18,129.54 | v153.67,149.86 154.94,149.86 155.58,149.22 155.58,142.88 154.94,142.24 v153.67,142.24 | v54.61,149.86 55.25,149.86 55.88,149.22 55.88,142.88 55.25,142.24 v54.61,142.24 | v87.63,149.86 88.27,149.86 88.9,149.22 88.9,142.88 88.27,142.24 v87.63,142.24 | v120.65,149.86 121.29,149.86 121.92,149.22 121.92,142.88 121.29,142.24 v120.65,142.24
  Top 0.762: v182.25,129.54 v170.18,129.54
  Bottom 0.508: SV6.4 v110.49,91.44 MASTER.5V 110.49,85.09 v113.67,81.91 | SV6.1 v118.11,91.44 MASTER.VIN | 60.96,65.02 B1.AREF 55.5,65.02 41.28,50.8 B1.5V | 60.96,65.02 61.34,65.02 | R2.2 R1.2 R4.1 180.34,101.6 | v170.18,129.54 170.18,134.62 R3.1 | 60.96,65.02 68.33,65.02 72.39,60.96 72.39,42.55 76.84,38.1 95.25,38.1 96.52,39.37 MASTER.AREF 96.52,41.91 v99.06,44.45
  Bottom 0.61: B1.VIN 8.26,43.18 6.35,45.09 6.35,48.89 8.26,50.8 B1.5V | R1.2 163.2,100.33 161.29,98.42 120.02,98.42 118.11,96.52 SV6.1 | v50.17,172.72 48.26,170.81 BR.1 48.26,163.19 49.53,161.93 49.53,151.13 50.8,149.86 SLAVE_2.RAW v54.61,149.86 | v82.55,172.72 81.28,171.45 FR.1 81.28,161.93 82.55,160.66 82.55,150.5 83.19,149.86 SLAVE_1.RAW v87.63,149.86 | v115.57,172.72 114.3,171.45 FL.1 114.3,162.56 115.57,161.29 115.57,150.5 116.21,149.86 SLAVE_0.RAW v120.65,149.86 | v148.59,172.72 147.32,171.45 BL.1 147.32,161.93 148.59,160.66 148.59,151.13 149.86,149.86 SLAVE_3.RAW v153.67,149.86 | v153.67,142.24 SLAVE_3.5V | v54.61,142.24 SLAVE_2.5V | SLAVE_1.5V v87.63,142.24 | v120.65,142.24 SLAVE_0.5V
  Bottom 0.762: C8.1 C6.1 | 179.07,129.54 v182.25,129.54 | P_I/P1.3 182.88,93.98 180.34,96.52 180.34,101.6 C9.1 179.07,105.41 C1.+
  Bottom 0.813: C8.1 C5.1 179.07,129.54 C2.+ | C6.1 C7.1 185.42,129.54 | 185.42,129.54 C3.+ | C4.+ C2.+ | 179.07,105.41 C2.+ | v182.25,129.54 185.42,129.54 | v162.56,40.64 MASTER.5V@1 MASTER.5V@2 SV8.1 SV8.2
+12V
  Bottom 0.559: LINE_AUX.9 116.71,7.75 119.38,5.08 135.89,5.08 | 135.89,5.08 151.13,5.08 | 151.13,5.08 166.37,5.08 168.91,5.08 184.96,21.13 P_I/P2.3 | LINE_F.9 135.76,5.08 135.89,5.08 | LINE_L.9 151,5.08 151.13,5.08
  Bottom 0.61: LINE_R.9 166.24,5.08 166.37,5.08
A1
  Bottom 0.61: SLAVE_0.D2 100.33,139.7 99.7,140.33 99.7,158.12 102.87,161.29 105.41,161.29 107.32,161.29 109.22,163.19 FL.3
A2
  Bottom 0.61: 73.03,161.29 74.3,161.29 | FR.3 76.2,163.19 74.3,161.29 | SLAVE_1.D2 67.31,139.7 66.68,140.33 66.68,158.12 69.85,161.29 | 69.85,161.29 74.3,161.29 | 74.3,161.29 69.85,161.29
A3
  Bottom 0.61: SLAVE_2.D2 34.29,139.7 33.66,140.33 33.66,158.12 36.83,161.29 41.28,161.29 43.18,163.19 BR.3
A4
  Bottom 0.61: SLAVE_3.D2 133.35,139.7 132.72,140.33 132.72,158.12 135.89,161.29 139.7,161.29 142.24,163.83 BL.3
B1
  Bottom 0.61: SLAVE_0.D3 99.7,137.16 98.43,138.43 98.43,156.21 | 98.43,156.21 98.43,156.84 | 98.43,156.21 98.43,158.75 102.87,163.19 106.05,163.19 106.68,163.83 FL.4
B2
  Bottom 0.61: SLAVE_1.D3 66.68,137.16 65.41,138.43 65.41,153.67 | FR.4 73.66,163.83 73.03,163.19 69.85,163.19 65.41,158.75 65.41,153.67 | 65.41,153.67 65.41,155.57
B3
  Bottom 0.61: SLAVE_2.D3 34.29,137.16 32.39,139.06 32.39,158.75 36.83,163.19 40.01,163.19 40.64,163.83 BR.4
B4
  Bottom 0.61: SLAVE_3.D3 132.72,137.16 131.45,138.43 131.45,158.75 135.89,163.19 139.06,163.19 139.7,163.83 BL.4
D8
  Bottom 0.508: MASTER.8 SV2.6 114.3,27.94 111.76,25.4 78.11,25.4 64.77,38.73 64.77,45.72 63.25,47.24 B1.D8
D9
  Bottom 0.508: MASTER.9 SV2.5 111.76,28.58 | B1.D9 65.15,49.78 66.04,48.89 66.04,39.37 78.74,26.67 109.86,26.67 111.76,28.58 | 111.76,28.58
D10
  Bottom 0.508: MASTER.10 SV2.4 109.22,29.21 107.95,27.94 79.38,27.94 67.31,40 67.31,50.8 65.79,52.32 61.34,52.32 B1.D10
D11
  Bottom 0.508: MASTER.11 SV2.3 106.68,30.48 105.41,29.21 80.01,29.21 68.58,40.64 68.58,53.98 67.69,54.86 60.96,54.86 | B1.D11 60.96,54.86 | 60.96,54.86 61.34,54.86
D12
  Bottom 0.508: MASTER.12 SV2.2 104.14,31.12 103.51,30.48 80.65,30.48 69.85,41.27 69.85,54.61 67.06,57.4 B1.D12
D13
  Bottom 0.508: MASTER.13 SV2.1 101.6,32.39 100.97,31.75 81.28,31.75 71.12,41.91 71.12,55.88 67.31,59.69 67.06,59.94 61.34,59.94 B1.D13
DIR_BL  (via drill 0.75)
  Top 0.61: v140.97,156.21 140.34,155.57 135.89,155.57 128.91,148.59 128.91,130.81 v132.72,127
  Bottom 0.61: SLAVE_3.D7 v132.72,127 | MD_BL.1 v140.97,156.21
DIR_BR  (via drill 0.75)
  Top 0.61: v41.91,155.57 41.28,154.94 36.83,154.94 29.85,147.95 29.85,132.08 29.85,130.81 v33.66,127
  Bottom 0.61: MD_BR.1 v41.91,155.57 | SLAVE_2.D7 v33.66,127
DIR_FL  (via drill 0.75)
  Top 0.61: v107.95,155.57 107.32,154.94 102.87,154.94 95.89,147.95 95.89,130.81 v99.7,127
  Bottom 0.61: MD_FL.1 v107.95,155.57 | v99.7,127 SLAVE_0.D7
DIR_FR  (via drill 0.75)
  Top 0.61: v66.68,127 62.87,130.81 62.87,147.95 69.85,154.94 74.3,154.94 v74.93,155.57
  Bottom 0.61: SLAVE_1.D7 v66.68,127 | v74.93,155.57 MD_FR.1
GND  (via drill 0.75)
  Top 0.432: MASTER.GND@3 SV8.35 SV8.36
  Top 0.508: MASTER.GND@2 MASTER.GND@3 SV8.36 182.45,83.82
  Top 0.61: v40.01,142.24 43.82,146.05 v46.99,146.05 | v80.01,146.05 77.47,146.05 76.84,146.05 v73.03,142.24 | v106.05,142.24 109.86,146.05 v113.03,146.05 | v139.7,142.24 143.51,146.05 v146.69,146.05
  Top 0.813: 142.24,6.35 127,6.35 v124.46,8.89 120.65,5.08 115.57,5.08 v112.71,7.94 99.06,21.59 v99.06,37.47 | 142.24,6.35 157.48,6.35 | 157.48,6.35 167.64,6.35 v170.18,8.89 176.53,8.89 v190.5,22.86 | v139.7,8.89 142.24,6.35 | v154.94,8.89 157.48,6.35 | v48.9,175.89 v81.92,175.89 v114.94,175.89 v147.96,175.89
  Bottom 0.508: MASTER.GND@4 v99.06,37.47 | B1.GND@2 12.7,45.72 28.58,29.84 28.58,24.13 29.99,22.72 B1.GND@4 | 177.8,152.4 177.8,143.51 | v112.71,7.94 111.13,6.35 48.53,6.35
  Bottom 0.559: LINE_AUX.10 v124.46,8.89 | LINE_F.10 v139.7,8.89 | LINE_L.10 v154.94,8.89 | M_RST.1 193.32,80.29 | B1.GND@4 31.7,19.1 44.45,6.35 48.53,6.35 | 185.14,80.29 M_RST.2
  Bottom 0.61: BL.2 144.78,168.28 | 144.78,168.28 144.78,172.72 v147.96,175.89 | v114.94,175.89 111.76,172.72 FL.2 111.76,161.93 113.03,160.66 MD_FL.3 113.03,156.84 114.32,155.56 114.32,148.06 114.3,148.04 114.3,147.95 114.62,147.64 | 171.45,164.47 172.09,164.47 | 144.78,168.28 144.78,161.93 146.05,160.66 MD_BL.3 146.05,156.84 147.34,155.56 147.34,148.59 148.28,147.65 | 81.28,148.04 81.3,148.06 81.3,155.56 | 81.28,147.95 81.6,147.64 81.92,147.32 | 48.28,155.56 48.28,148.06 48.64,147.7 | SLAVE_2.GND1 v40.01,142.24 | SLAVE_0.GND1 v106.05,142.24 | SLAVE_3.GND1 v139.7,142.24 | SLAVE_1.GND1 v73.03,142.24
  Bottom 0.762: 186.69,104.14 C9.2 | 190.5,142.24 C6.2 | B1.GND@1 B1.GND@2
  Bottom 0.813: C1.- C2.- C5.2 C8.2 173.99,142.24 175.26,143.51 177.8,143.51 | 186.69,104.14 190.5,107.95 C3.- C4.- C7.2 C6.2 | 177.8,143.51 189.23,143.51 190.5,142.24 | C9.2 185.42,101.32 P_I/P1.2 190.96,95.78 P_I/P1.1 190.96,92.2 195.54,87.63 195.54,82.5 193.32,80.29 | LINE_R.10 v170.18,8.89 | P_I/P2.2 190.96,32.28 P_I/P2.1 190.96,23.32 v190.5,22.86 | SV6.3 MASTER.GND MASTER.GND@1 | SV6.2 MASTER.GND@1 | MASTER.GND@2 182.88,83.82 184.15,82.55 184.15,81.28 185.14,80.29 | MASTER.GND@1 115.57,85.09 131.45,69.22 136.53,69.22 138.56,67.18 ICSP.6 | 177.8,152.4 171.73,158.47 S_RST.2 S_RST.1 | v48.9,175.89 45.72,172.72 BR.2 45.72,161.93 46.99,160.66 MD_BR.3 46.99,156.84 48.28,155.56 | v81.92,175.89 78.74,172.72 FR.2 78.74,161.93 80.01,160.66 MD_FR.3 80.01,156.84 81.3,155.56 | v147.96,175.89 159.39,164.47 171.45,164.47 | 177.8,143.51 177.8,158.75 172.09,164.47 | SLAVE_0.GND 114.94,147.32 114.62,147.64 v113.03,146.05 | SLAVE_3.GND 148.61,147.32 148.28,147.65 v146.69,146.05 | 81.28,148.04 81.28,147.95 | 81.92,147.32 SLAVE_1.GND | SLAVE_2.GND 49.02,147.32 48.64,147.7 v46.99,146.05 | v80.01,146.05 81.6,147.64 | M_RST.2 M_RST.1
ICSP_RST  (via drill 0.75, 0.76)
  Top 0.559: v132.72,66.04 120.65,53.98 90.17,53.98 52.71,16.51 v46.99,16.51
  Bottom 0.559: ICSP.5 v132.72,66.04 | B1.RESET@2 35.02,28.58 42.55,28.58 46.36,24.77 46.36,20.95 45.09,19.69 45.09,17.15 45.72,16.51 v46.99,16.51
ICSP_VCC  (via drill 0.75, 0.76)
  Top 0.559: v132.72,57.78 123.19,48.26 93.35,48.26 55.88,10.8 v46.99,10.8
  Bottom 0.559: ICSP.2 138.56,58.55 137.8,57.78 v132.72,57.78 | B1.VCC 36.78,19.1 45.09,10.8 v46.99,10.8
MISO  (via drill 0.75, 0.76)
  Top 0.559: v132.72,60.96 121.92,50.16 92.71,50.16 55.25,12.7 v46.99,12.7
  Bottom 0.559: ICSP.1 v132.72,60.96 | B1.MISO 37.61,25.26 38.74,24.13 38.74,19.05 43.18,14.6 45.09,12.7 v46.99,12.7
MOSI  (via drill 0.75, 0.76)
  Top 0.559: v132.72,55.24 123.83,46.36 93.98,46.36 56.52,8.89 v46.99,8.89
  Bottom 0.559: ICSP.4 139.7,63.5 140.97,62.23 140.97,57.15 139.06,55.24 v132.72,55.24 | B1.MOSI 34.29,22.67 34.29,19.69 45.09,8.89 v46.99,8.89
N$1
  Bottom 0.508: MASTER.14 SV3.1
N$2
  Bottom 0.508: SV7.1 78.11,17.15 78.11,11.43 80.65,8.89 83.19,8.89 84.44,10.14 USB_DATA.4
N$3
  Bottom 0.508: SV7.2 81.36,17.86 81.36,17.73 80.57,16.94 80.44,16.94 79.38,15.88 79.38,12.7 80.48,11.6 USB_DATA.3
N$4
  Bottom 0.508: SV7.3 85.09,17.78 81.94,14.62 USB_DATA.2
N$5
  Bottom 0.508: SV7.4 87.63,17.78 84.44,14.59 USB_DATA.1
N$7
  Bottom 0.508: MASTER.24 SV9.1
N$8
  Bottom 0.508: MASTER.0 SV1.8
N$9
  Bottom 0.508: MASTER.1 SV1.7
N$10
  Bottom 0.508: MASTER.15 SV3.2
N$11
  Bottom 0.508: MASTER.16 SV3.3
N$12
  Bottom 0.508: MASTER.17 SV3.4
N$13
  Bottom 0.432: MASTER.53 SV8.33
N$14
  Bottom 0.508: MASTER.6 SV1.2
N$15
  Bottom 0.508: MASTER.7 SV1.1
N$16
  Bottom 0.432: MASTER.51 SV8.31
N$17
  Bottom 0.508: MASTER.26 SV9.2
N$18
  Bottom 0.432: MASTER.47 SV8.27
N$19
  Bottom 0.432: SV8.29 MASTER.49
N$20
  Bottom 0.432: SV8.25 MASTER.45
N$21
  Bottom 0.432: MASTER.43 SV8.23
N$22
  Bottom 0.432: SV8.21 MASTER.41
N$23
  Bottom 0.432: MASTER.39 SV8.19
N$24
  Bottom 0.508: SV4.8 MASTER.A0
N$25
  Bottom 0.508: SV4.7 MASTER.A1
N$26
  Bottom 0.508: SV4.6 MASTER.A2
N$27
  Bottom 0.508: SV4.5 MASTER.A3
N$28
  Bottom 0.508: SV4.4 MASTER.A4
N$29
  Bottom 0.508: SV4.3 MASTER.A5
N$30
  Bottom 0.508: SV4.2 MASTER.A6
N$31
  Bottom 0.508: SV4.1 MASTER.A7
N$32
  Bottom 0.508: SV5.8 MASTER.A8
N$33
  Bottom 0.508: SV5.7 MASTER.A9
N$34
  Bottom 0.508: SV5.6 MASTER.A10
N$35
  Bottom 0.508: SV5.5 MASTER.A11
N$36
  Bottom 0.508: SV5.4 MASTER.A12
N$37
  Bottom 0.508: SV5.3 MASTER.A13
N$38
  Bottom 0.508: SV5.2 MASTER.A14
N$39
  Bottom 0.508: SV5.1 MASTER.A15
N$40
  Bottom 0.432: SV8.17 MASTER.37
N$41
  Bottom 0.432: MASTER.35 SV8.15
N$42
  Bottom 0.432: SV8.13 MASTER.33
N$43
  Bottom 0.432: MASTER.31 SV8.11
N$44
  Bottom 0.432: SV8.9 MASTER.29
N$45
  Bottom 0.432: MASTER.27 SV8.7
N$46
  Bottom 0.432: SV8.5 MASTER.25
N$47
  Bottom 0.432: MASTER.23 SV8.3
N$58
  Bottom 0.508: MASTER.28 SV9.3
N$65
  Bottom 0.508: MASTER.30 SV9.4
N$66
  Bottom 0.508: MASTER.32 SV9.5
N$67
  Bottom 0.508: MASTER.34 SV9.6
N$68
  Bottom 0.508: MASTER.36 SV9.7
N$70
  Bottom 0.508: MASTER.38 SV9.8
N$71
  Bottom 0.508: MASTER.40 SV9.9
N$72
  Bottom 0.508: MASTER.42 SV9.10
N$73
  Bottom 0.508: MASTER.52 SV9.15
N$74
  Bottom 0.508: MASTER.50 SV9.14
N$75
  Bottom 0.508: MASTER.48 SV9.13
N$76
  Bottom 0.508: MASTER.46 SV9.12
N$77
  Bottom 0.508: MASTER.44 SV9.11
PWM_BL  (via drill 0.75)
  Top 0.61: v143.51,154.94 143.51,154.31 142.24,153.03 135.89,153.03 130.18,147.32 130.18,132.08 v132.72,129.54
  Bottom 0.61: SLAVE_3.D6 v132.72,129.54 | MD_BL.2 v143.51,154.94
PWM_BR  (via drill 0.75)
  Top 0.61: v33.66,129.54 31.12,132.08 31.12,146.69 31.12,147.32 36.83,153.03 43.18,153.03 v44.45,154.31
  Bottom 0.61: SLAVE_2.D6 v33.66,129.54 | MD_BR.2 v44.45,154.31
PWM_FL  (via drill 0.75)
  Top 0.61: v99.7,129.54 97.16,132.08 97.16,147.32 102.87,153.03 109.22,153.03 110.49,154.31 v110.49,154.94
  Bottom 0.61: SLAVE_0.D6 v99.7,129.54 | MD_FL.2 v110.49,154.94
PWM_FR  (via drill 0.75)
  Top 0.61: v66.68,129.54 64.14,132.08 64.14,147.32 69.85,153.03 76.2,153.03 77.47,154.31 v77.47,154.94
  Bottom 0.61: SLAVE_1.D6 v66.68,129.54 | v77.47,154.94 MD_FR.2
RST_M  (via drill 0.75)
  Top 0.508: v105.41,86.36 107.32,84.45 v130.18,84.45 | v173.99,88.9 171.45,86.36 160.66,86.36 158.75,84.45 v154.94,84.45
  Bottom 0.432: M_RST.4 179.35,91.44 R4.2 v173.99,88.9
  Bottom 0.508: SV6.6 MASTER.RESET v105.41,86.36 | v130.18,84.45 v154.94,84.45
  Bottom 0.559: M_RST.4 M_RST.3 | v105.41,86.36 97.16,78.11 54.61,78.11 32.39,55.88 B1.RESET@1
RST_S  (via drill 0.75)
  Top 0.61: v145.42,113.03 143.51,111.12 v123.83,111.12 v90.17,111.12 v57.79,111.12
  Bottom 0.508: R3.2 168.99,149.94 S_RST.4
  Bottom 0.61: SLAVE_2.RST 44.45,144.78 | 72.39,144.78 SLAVE_1.RST1 SLAVE_1.RST | 77.47,144.78 SLAVE_1.RST | SLAVE_0.RST 110.8,144.78 | 105.1,144.78 SLAVE_0.RST1 SLAVE_0.RST | SLAVE_3.RST 145.42,144.78 | 145.42,144.78 144.15,144.78 | 139.06,144.78 SLAVE_3.RST1 145.42,144.78 | SLAVE_3.RST 153.67,144.78 160.02,151.13 160.02,153.03 160.93,153.95 S_RST.3 | SLAVE_2.RST1 SLAVE_2.RST | 145.42,144.78 SLAVE_3.RST | v57.79,111.12 57.15,111.76 57.15,144.14 56.52,144.78 SLAVE_2.RST | v145.42,113.03 145.42,144.78 | SLAVE_1.RST 87.63,144.78 89.54,144.78 90.17,144.14 v90.17,111.12 | SLAVE_0.RST 120.65,144.78 123.19,144.78 123.83,144.14 v123.83,111.12
  Bottom 0.762: S_RST.3 S_RST.4
RX_L  (via drill 0.75)
  Top 0.508: v123.19,22.86 v138.43,22.86 v151.13,22.86 161.29,22.86 v163.83,25.4
  Bottom 0.508: MASTER.19 SV3.6 153.67,31.75 154.94,30.48 158.75,30.48 v163.83,25.4 165.23,24 LINE_R.2 | LINE_AUX.2 119.51,20.45 121.92,22.86 v123.19,22.86 | LINE_F.2 134.62,19.18 134.62,20.32 137.16,22.86 v138.43,22.86 | LINE_L.2 149.99,21.72 v151.13,22.86
SCK  (via drill 0.75, 0.76)
  Top 0.559: v132.72,63.5 121.29,52.07 94.62,52.07 91.44,52.07 53.98,14.6 v46.99,14.6
  Bottom 0.559: ICSP.3 v132.72,63.5 | B1.SCK 36.29,27.3 41.54,27.3 44.79,24.05 44.79,21.67 43.82,20.69 43.82,16.51 45.72,14.6 v46.99,14.6
SCL  (via drill 0.75)
  Top 0.508: v146.05,103.5 144.15,101.6 144.15,69.85 147.96,66.04 147.96,52.7 v153.67,46.99
  Top 0.61: v146.05,103.5 146.05,106.68 144.15,108.59 v138.43,108.59 v105.41,108.59 v72.39,108.59 41.28,108.59 v39.37,110.49
  Bottom 0.508: SV3.8 MASTER.21 158.75,41.91 v153.67,46.99 | R2.1 149.86,103.5 v146.05,103.5
  Bottom 0.61: SLAVE_2.D5 38.74,132.08 39.37,131.44 v39.37,110.49 | SLAVE_1.D5 71.76,132.08 72.39,131.44 v72.39,108.59 | SLAVE_0.D5 104.78,132.08 105.41,131.44 v105.41,108.59 | SLAVE_3.D5 137.8,132.08 138.43,131.44 v138.43,108.59
SDA  (via drill 0.75)
  Top 0.508: v151.13,46.99 146.37,51.75 146.37,65.72 142.88,69.22 142.88,101.6 v140.97,103.5
  Top 0.61: v140.97,103.5 v107.95,103.5 v74.93,103.5 45.72,103.5 v44.45,104.78
  Bottom 0.508: SV3.7 MASTER.20 156.21,41.91 v151.13,46.99 | R1.1 151.77,100.33 142.24,100.33 140.97,101.6 v140.97,103.5
  Bottom 0.61: SLAVE_2.D4 38.74,134.62 40.64,132.72 40.64,108.59 v44.45,104.78 | SLAVE_1.D4 71.76,134.62 73.66,132.72 73.66,104.78 v74.93,103.5 | SLAVE_0.D4 104.78,134.62 106.68,132.72 106.68,104.78 v107.95,103.5 | SLAVE_3.D4 137.8,134.62 139.7,132.72 139.7,104.78 v140.97,103.5
TX_L  (via drill 0.75)
  Top 0.508: v160.02,25.4 v149.86,25.4 v134.62,25.4 v119.38,25.4
  Bottom 0.508: MASTER.18 SV3.5 151.13,30.48 152.4,29.21 156.21,29.21 v160.02,25.4 162.56,22.86 162.43,22.73 LINE_R.1 | LINE_AUX.1 116.71,22.73 v119.38,25.4 | LINE_F.1 132.08,19.18 132.08,22.86 v134.62,25.4 | LINE_L.1 147.19,22.73 v149.86,25.4
UEN_AUX
  Bottom 0.508: MASTER.5 SV1.3 114.3,25.4 114.3,17.78 115.57,16.51 LINE_AUX.3
UEN_F
  Bottom 0.508: MASTER.4 SV1.4 125.73,20.32 129.54,16.51 LINE_F.3
UEN_L
  Bottom 0.508: MASTER.3 SV1.5 128.27,31.75 130.81,29.21 138.43,29.21 142.24,25.4 142.24,19.05 144.78,16.51 LINE_L.3 | LINE_L.3 147.32,16.51 LINE_L.3
UEN_R
  Bottom 0.508: MASTER.2 SV1.6 130.81,31.75 132.08,30.48 148.59,30.48 158.75,20.32 158.75,17.78 160.02,16.51 LINE_R.3